# Altium schematic sheet Encoder AFE.SchDoc
size A4
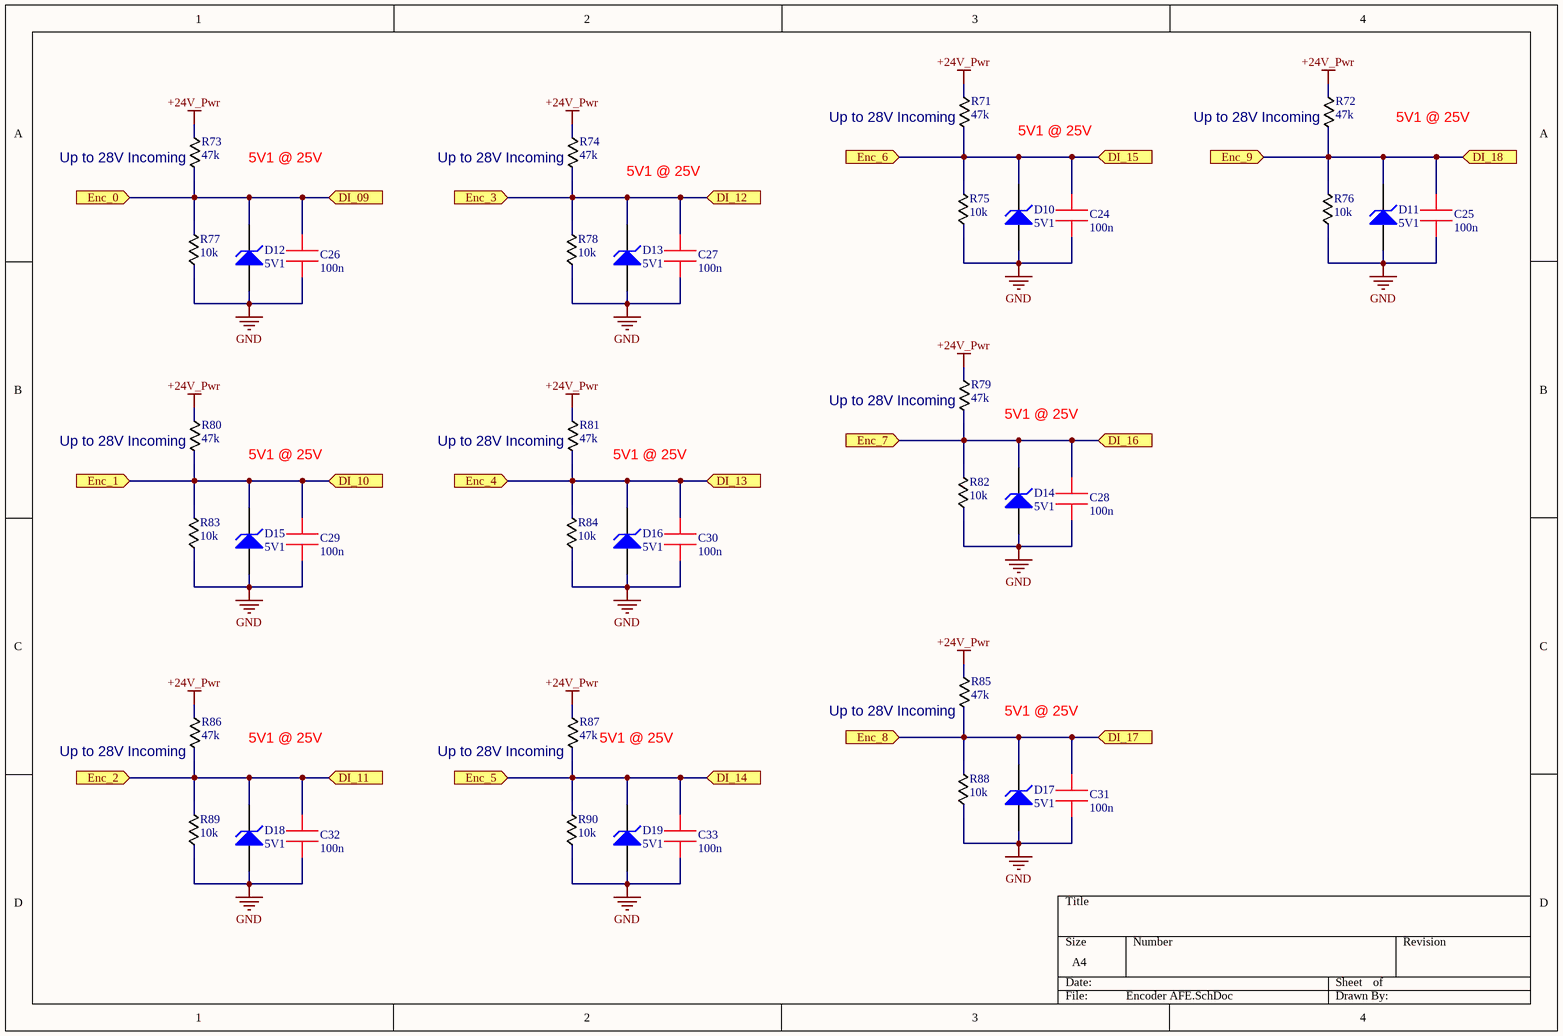
[diagram p0: Encoder AFE.SchDoc]

## Parts
C24  100n  [0603]
C25  100n  [0603]
C26  100n  [0603]
C27  100n  [0603]
C28  100n  [0603]
C29  100n  [0603]
C30  100n  [0603]
C31  100n  [0603]
C32  100n  [0603]
C33  100n  [0603]
D10  5V1  [SOT23]
D11  5V1  [SOT23]
D12  5V1  [SOT23]
D13  5V1  [SOT23]
D14  5V1  [SOT23]
D15  5V1  [SOT23]
D16  5V1  [SOT23]
D17  5V1  [SOT23]
D18  5V1  [SOT23]
D19  5V1  [SOT23]
R71  47k  [0603]
R72  47k  [0603]
R73  47k  [0603]
R74  47k  [0603]
R75  10k  [0603]
R76  10k  [0603]
R77  10k  [0603]
R78  10k  [0603]
R79  47k  [0603]
R80  47k  [0603]
R81  47k  [0603]
R82  10k  [0603]
R83  10k  [0603]
R84  10k  [0603]
R85  47k  [0603]
R86  47k  [0603]
R87  47k  [0603]
R88  10k  [0603]
R89  10k  [0603]
R90  10k  [0603]

## Ports
DI_09, DI_10, DI_11, DI_12, DI_13, DI_14, DI_15, DI_16, DI_17, DI_18, Enc_0, Enc_1, Enc_2, Enc_3, Enc_4, Enc_5, Enc_6, Enc_7, Enc_8, Enc_9

## Nets
+24V_Pwr: R71.1 R72.1 R73.1 R74.1 R79.1 R80.1 R81.1 R85.1 R86.1 R87.1
GND: C24.1 C25.1 C26.1 C27.1 C28.1 C29.1 C30.1 C31.1 C32.1 C33.1 D10.1(A) D11.1(A) D12.1(A) D13.1(A) D14.1(A) D15.1(A) D16.1(A) D17.1(A) D18.1(A) D19.1(A) R75.1 R76.1 R77.1 R78.1 R82.1 R83.1 R84.1 R88.1 R89.1 R90.1
DI_09: C26.2 D12.2(K) R73.2 R77.2 ; port DI_09, port Enc_0
DI_10: C29.2 D15.2(K) R80.2 R83.2 ; port DI_10, port Enc_1
DI_11: C32.2 D18.2(K) R86.2 R89.2 ; port DI_11, port Enc_2
DI_12: C27.2 D13.2(K) R74.2 R78.2 ; port DI_12, port Enc_3
DI_13: C30.2 D16.2(K) R81.2 R84.2 ; port DI_13, port Enc_4
DI_14: C33.2 D19.2(K) R87.2 R90.2 ; port DI_14, port Enc_5
DI_15: C24.2 D10.2(K) R71.2 R75.2 ; port DI_15, port Enc_6
DI_16: C28.2 D14.2(K) R79.2 R82.2 ; port DI_16, port Enc_7
DI_17: C31.2 D17.2(K) R85.2 R88.2 ; port DI_17, port Enc_8
DI_18: C25.2 D11.2(K) R72.2 R76.2 ; port DI_18, port Enc_9

## Notes on the sheet
- (near R73) Up to 28V Incoming
- 5V1 @ 25V
- (near R74) Up to 28V Incoming
- (near R71) Up to 28V Incoming
- (near R72) Up to 28V Incoming
- (near R80) Up to 28V Incoming
- (near R81) Up to 28V Incoming
- (near R79) Up to 28V Incoming
- (near R79) 5V1 @ 25V
- (near R81) 5V1 @ 25V
- (near R85) Up to 28V Incoming
- (near R85) 5V1 @ 25V
- (near R86) Up to 28V Incoming
- (near R87) Up to 28V Incoming
- (near R87) 5V1 @ 25V

## Library data of the parts
C24-C33 = 0603 CAP: CC0603KRX7R9BB104
D10-D19 = D Zener: BZX84C5V1LT1G
R71-R74 R79-R81 R85-R87 = 0603 RES: RC0603JR-0747K
R75-R78 R82-R84 R88-R90 = 0603 RES: RT0603FRE0710KL